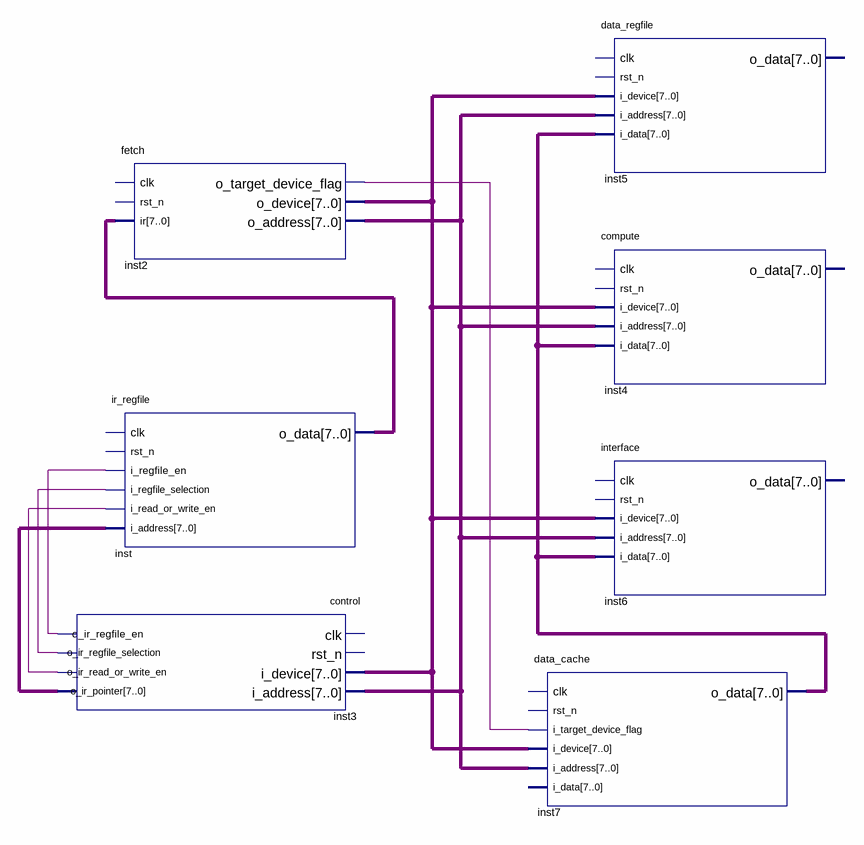
[diagram p0: schematic sheet]
// Quartus schematic processor.bdf as structural Verilog: 7 symbols, 0 pins
module processor (
);

  wire inst2_o_target_device_flag, inst3_o_ir_read_or_write_en, inst3_o_ir_regfile_en,
       inst3_o_ir_regfile_selection;
  wire [7:0] inst2_o_address, inst2_o_device, inst3_o_ir_pointer, inst7_o_data, inst_o_data;

  control inst3 (
    .i_device(inst2_o_device), .i_address(inst2_o_address), .o_ir_regfile_en(inst3_o_ir_regfile_en),
    .o_ir_regfile_selection(inst3_o_ir_regfile_selection),
    .o_ir_read_or_write_en(inst3_o_ir_read_or_write_en), .o_ir_pointer(inst3_o_ir_pointer));  // open: clk, rst_n
  fetch inst2 (
    .ir(inst_o_data), .o_target_device_flag(inst2_o_target_device_flag), .o_device(inst2_o_device),
    .o_address(inst2_o_address));  // open: clk, rst_n
  ir_regfile inst (
    .i_regfile_en(inst3_o_ir_regfile_en), .i_regfile_selection(inst3_o_ir_regfile_selection),
    .i_read_or_write_en(inst3_o_ir_read_or_write_en), .i_address(inst3_o_ir_pointer), .o_data(inst_o_data));  // open: clk, rst_n
  data_regfile inst5 (
    .i_device(inst2_o_device), .i_address(inst2_o_address), .i_data(inst7_o_data));  // open: clk, rst_n, o_data
  compute inst4 (
    .i_device(inst2_o_device), .i_address(inst2_o_address), .i_data(inst7_o_data));  // open: clk, rst_n, o_data
  \interface  inst6 (
    .i_device(inst2_o_device), .i_address(inst2_o_address), .i_data(inst7_o_data));  // open: clk, rst_n, o_data
  data_cache inst7 (
    .i_target_device_flag(inst2_o_target_device_flag), .i_device(inst2_o_device),
    .i_address(inst2_o_address), .o_data(inst7_o_data));  // open: clk, rst_n, i_data
endmodule
